# Altium project PCB_Project1.PrjPCB
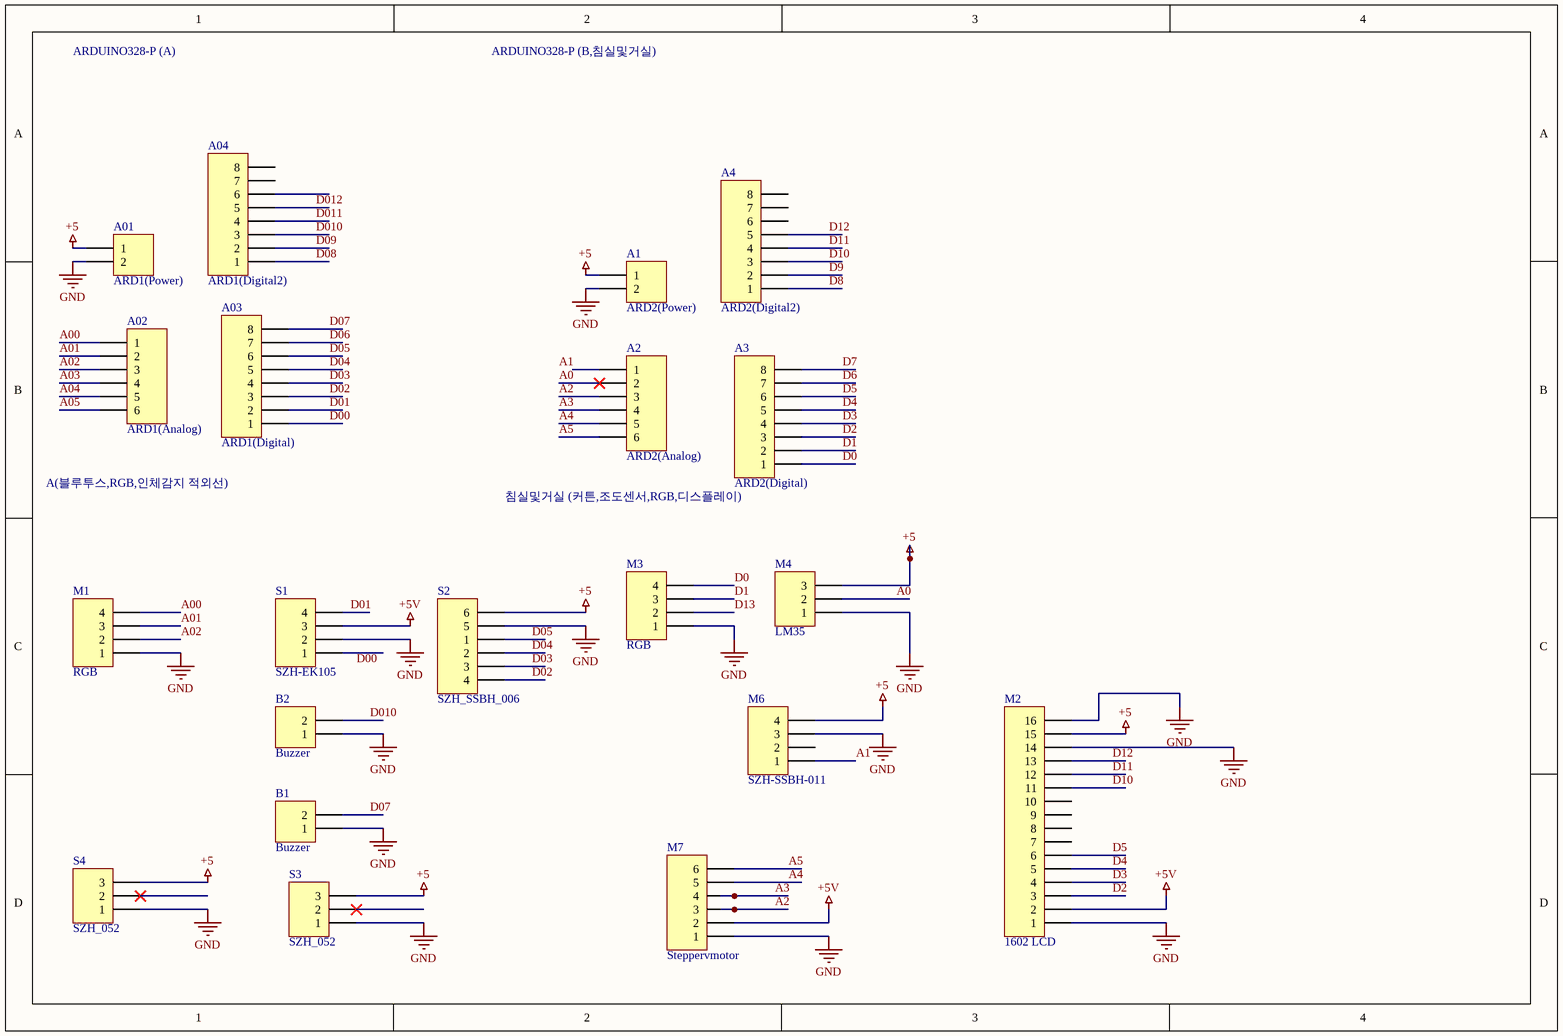
[diagram p0: smarthome_ALL.SchDoc]
1 sheet, 20 parts. Net scope: global (net labels, ports and power ports of the same name join across sheets).
Board file: 2smarthome.PcbDoc

## Sheet smarthome_ALL.SchDoc
size A4

### Parts
A01  ARD1(Power)  [HDR1X2]
A1  ARD2(Power)  [HDR1X2]
A02  ARD1(Analog)  [HDR1X6]
A2  ARD2(Analog)  [HDR1X6]
A03  ARD1(Digital)  [HDR1X8]
A3  ARD2(Digital)  [HDR1X8]
A04  ARD1(Digital2)  [HDR1X8]
A4  ARD2(Digital2)  [HDR1X8]
B1  Buzzer  [HDR1X2]
B2  Buzzer  [HDR1X2]
M1  RGB  [HDR1X4]
M2  1602 LCD  [HDR1X16]
M3  RGB  [HDR1X4]
M4  LM35  [HDR1X3]
M6  SZH-SSBH-011  [HDR1X4]
M7  Steppervmotor  [HDR1X6]
S1  SZH-EK105  [HDR1X4]
S2  SZH_SSBH_006  [HDR1X6]
S3  SZH_052  [HDR1X3]
S4  SZH_052  [HDR1X3]

### Nets
+5: A01.1 A1.1 M2.15 M4.3 M6.4 S2.6 S3.3 S4.3
+5V: M2.2 M7.2 S1.3
GND: A01.2 A1.2 B1.1 B2.1 M1.1 M2.1 M2.14 M2.16 M3.1 M4.1 M6.3 M7.1 S1.2 S2.5 S3.1 S4.1
A00: A02.1 M1.4
A0: A2.2 M4.2
A01: A02.2 M1.3
A1: M6.1
A02: A02.3 M1.2
A2: A2.3 M7.3
A3: A2.4 M7.4
A03: A02.4
A4: A2.5 M7.5
A04: A02.5
A5: A2.6 M7.6
A05: A02.6
D0: A3.1 M3.4
D00: A03.1
D1: A3.2 M3.3
D01: A03.2 S1.4
D02: A03.3 S2.4
D2: A3.3 M2.3
D03: A03.4 S2.3
D3: A3.4 M2.4
D04: A03.5 S2.2
D4: A3.5 M2.5
D05: A03.6 S2.1
D5: A3.6 M2.6
D06: A03.7
D6: A3.7
D07: A03.8 B1.2
D7: A3.8
D08: A04.1
D8: A4.1
D09: A04.2
D9: A4.2
D10: A4.3 M2.11
D010: A04.3 B2.2
D11: A4.4 M2.12
D011: A04.4
D12: A4.5 M2.13
D012: A04.5
D13: M3.2

Not connected (* = marked no-connect by the designer): A2 1; A04 6 7 8; A4 6 7 8; M2 7 8 9 10; M6 2; S1 1; S3 2*; S4 2*

### Notes on the sheet
- ARDUINO328-P (A)
- ARDUINO328-P (B,침실및거실)
- A(블루투스,RGB,인체감지 적외선)
- 침실및거실 (커튼,조도센서,RGB,디스플레이)
- Labels drawn without touching a wire or pin: A1, D00

### Library data of the parts
A01 A1 B1 B2 = Header 2: Header, 2-Pin; LatestRevisionDate: 17-Jul-2002; LatestRevisionNote: Re-released for DXP Platform.; Publisher: Altium Limited
A02 A2 M7 S2 = Header 6: Header, 6-Pin; LatestRevisionDate: 17-Jul-2002; LatestRevisionNote: Re-released for DXP Platform.; Publisher: Altium Limited
A03 A3 A04 A4 = Header 8: Header, 8-Pin; LatestRevisionDate: 17-Jul-2002; LatestRevisionNote: Re-released for DXP Platform.; Publisher: Altium Limited
M1 M3 M6 S1 = Header 4: Header, 4-Pin; LatestRevisionDate: 17-Jul-2002; LatestRevisionNote: Re-released for DXP Platform.; Publisher: Altium Limited
M2 = Header 16: Header, 16-Pin; LatestRevisionDate: 17-Jul-2002; LatestRevisionNote: Re-released for DXP Platform.; Publisher: Altium Limited
M4 S3 S4 = Header 3: Header, 3-Pin; LatestRevisionDate: 17-Jul-2002; LatestRevisionNote: Re-released for DXP Platform.; Publisher: Altium Limited